# Altium project CYBERGATE_V1_MASTERBOARD.PrjPcb (part 2 of 2)

## Sheet EtherCAT.SchDoc
size B
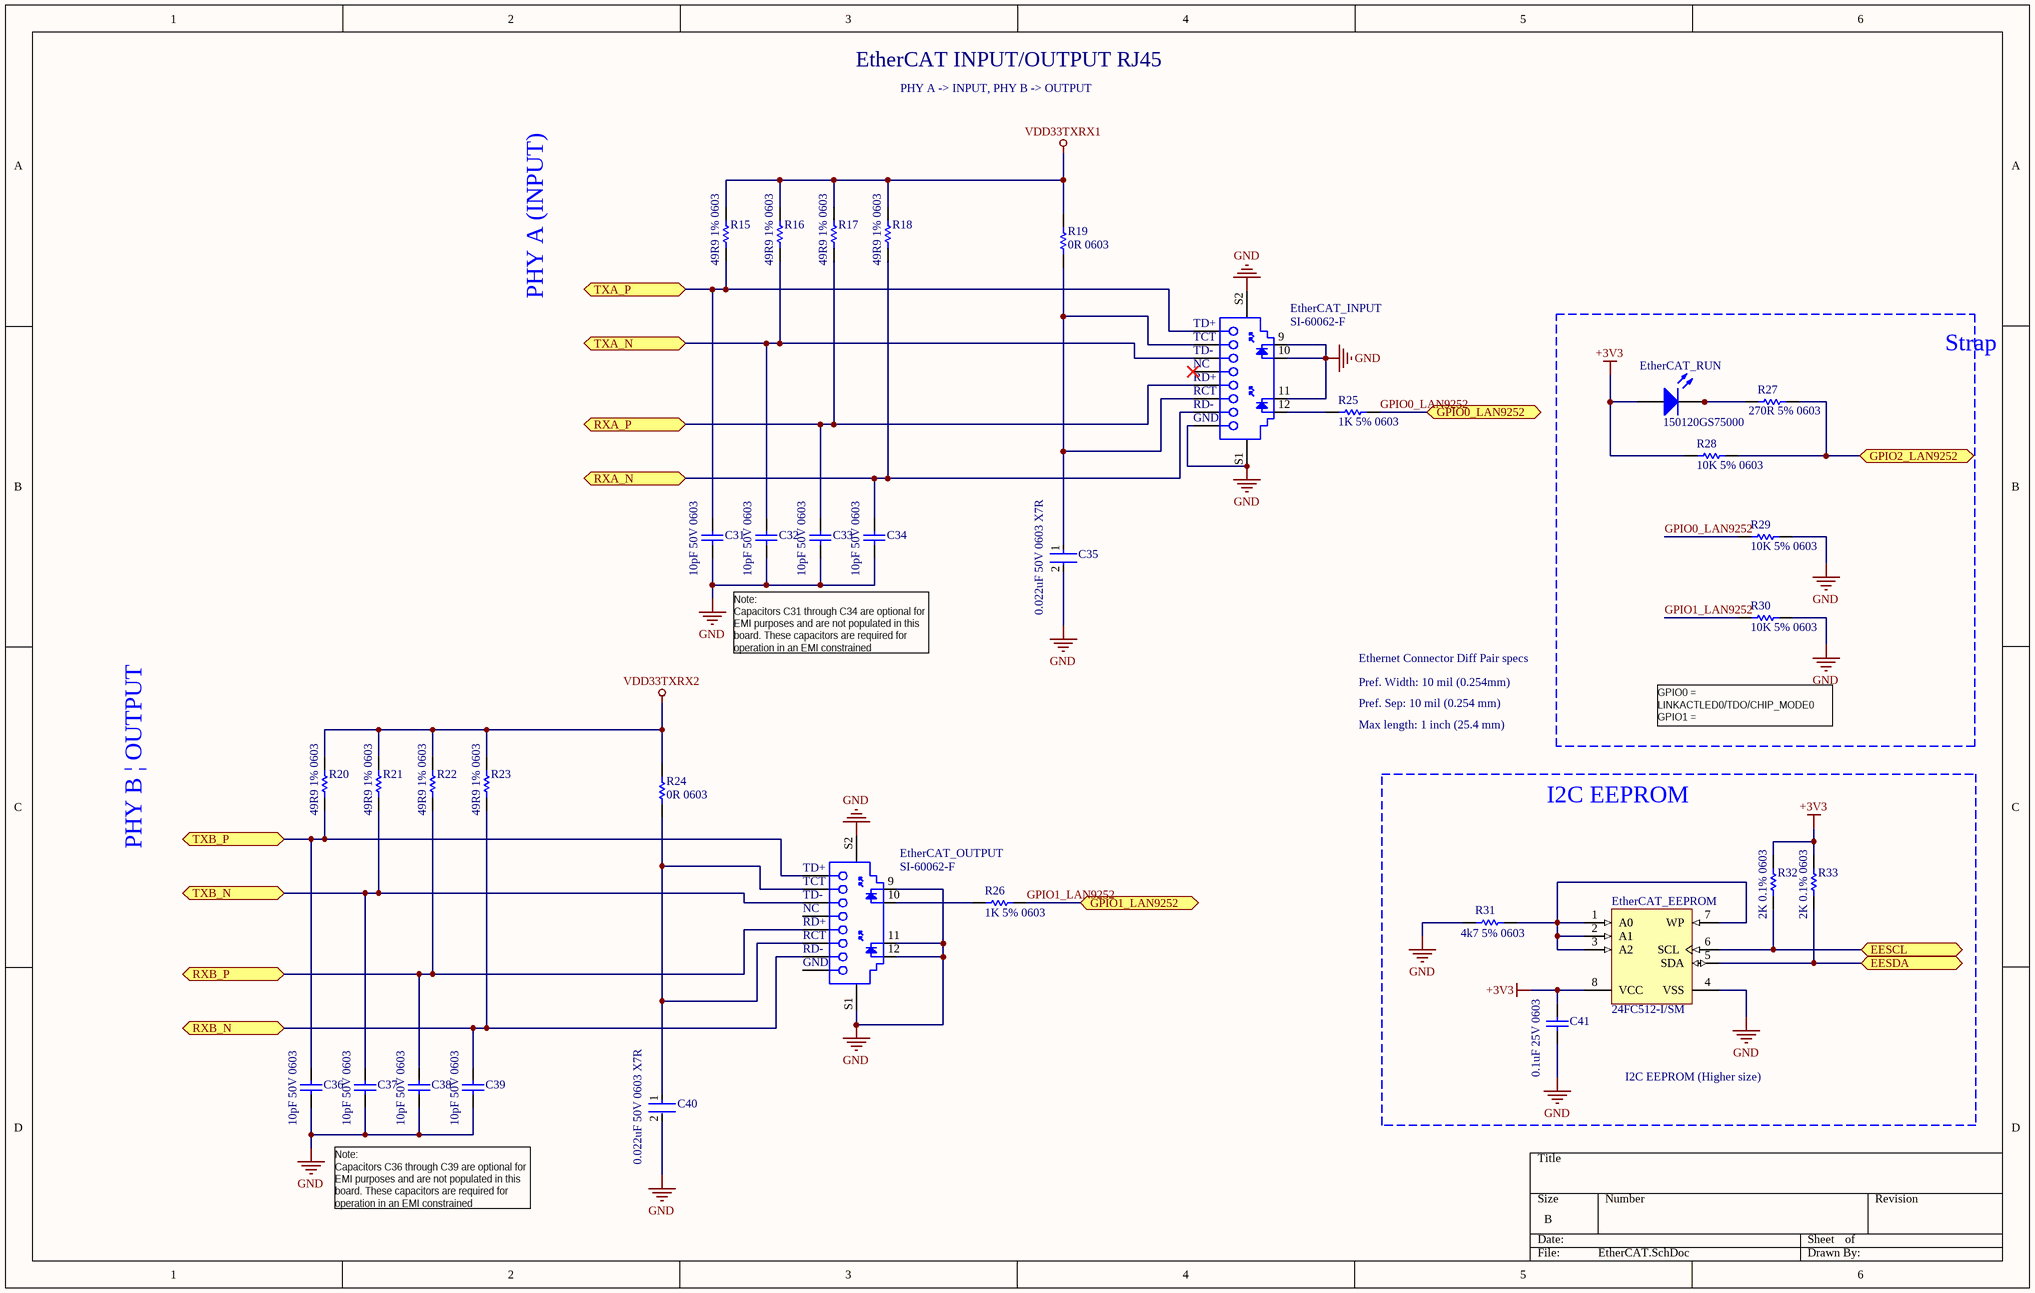
[diagram p4: EtherCAT.SchDoc]

### Parts
C31  10pF 50V 0603  [CAPC1608X90X35LL10T15]
C32  10pF 50V 0603  [CAPC1608X90X35LL10T15]
C33  10pF 50V 0603  [CAPC1608X90X35LL10T15]
C34  10pF 50V 0603  [CAPC1608X90X35LL10T15]
C35  0.022uF 50V 0603 X7R  [FP-C0603C-CF-MFG]
C36  10pF 50V 0603  [CAPC1608X90X35LL10T15]
C37  10pF 50V 0603  [CAPC1608X90X35LL10T15]
C38  10pF 50V 0603  [CAPC1608X90X35LL10T15]
C39  10pF 50V 0603  [CAPC1608X90X35LL10T15]
C40  0.022uF 50V 0603 X7R  [FP-C0603C-CF-MFG]
C41  0.1uF 25V 0603  [CAPC1608X90X35LL10T15]
EtherCAT_EEPROM  24FC512-I/SM  [SOIJ-SM8_M]
EtherCAT_INPUT  SI-60062-F  [BELF-SI-60062-F_V]
EtherCAT_OUTPUT  SI-60062-F  [BELF-SI-60062-F_V]
EtherCAT_RUN  150120GS75000  [1206_A]
R15  49R9 1% 0603  [RESC1608X55X25NL10T15]
R16  49R9 1% 0603  [RESC1608X55X25NL10T15]
R17  49R9 1% 0603  [RESC1608X55X25NL10T15]
R18  49R9 1% 0603  [RESC1608X55X25NL10T15]
R19  0R 0603  [RESC1608X55X25ML10T15]
R20  49R9 1% 0603  [RESC1608X55X25NL10T15]
R21  49R9 1% 0603  [RESC1608X55X25NL10T15]
R22  49R9 1% 0603  [RESC1608X55X25NL10T15]
R23  49R9 1% 0603  [RESC1608X55X25NL10T15]
R24  0R 0603  [RESC1608X55X25ML10T15]
R25  1K 5% 0603  [RESC1608X55X25NL10T15]
R26  1K 5% 0603  [RESC1608X55X25NL10T15]
R27  270R 5% 0603  [RESC1608X55X25LL10T15]
R28  10K 5% 0603  [RESC1608X55X25ML10T15]
R29  10K 5% 0603  [RESC1608X55X25ML10T15]
R30  10K 5% 0603  [RESC1608X55X25ML10T15]
R31  4k7 5% 0603  [RESC1608X55X25ML10T15]
R32  2K 0.1% 0603  [RESC1608X55X25ML10T15]
R33  2K 0.1% 0603  [RESC1608X55X25ML10T15]

### Blocks framed on the sheet
Strap: EtherCAT_RUN R27-R30
I2C EEPROM: C41 EtherCAT_EEPROM R31-R33

### Ports
EESCL (bidir), EESDA (bidir), GPIO0_LAN9252 (bidir), GPIO1_LAN9252 (bidir), GPIO2_LAN9252 (bidir), RXA_N (bidir), RXA_P (bidir), RXB_N (bidir), RXB_P (bidir), TXA_N (bidir), TXA_P (bidir), TXB_N (bidir), TXB_P (bidir)

### Nets
+3V3: C41.2 EtherCAT_EEPROM.8(VCC) EtherCAT_RUN.2(A) R28.2 R32.2 R33.2
GND: C31.1 C32.1 C33.1 C34.1 C35.2 C36.1 C37.1 C38.1 C39.1 C40.2 C41.1 EtherCAT_EEPROM.4(VSS) EtherCAT_INPUT.8(GND) EtherCAT_INPUT.9 EtherCAT_INPUT.10 EtherCAT_INPUT.11 EtherCAT_INPUT.S1 EtherCAT_INPUT.S2 EtherCAT_OUTPUT.9 EtherCAT_OUTPUT.11 EtherCAT_OUTPUT.12 EtherCAT_OUTPUT.S1 EtherCAT_OUTPUT.S2 R29.1 R30.1 R31.1
VDD33TXRX1: R15.2 R16.2 R17.2 R18.2 R19.2
VDD33TXRX2: R20.2 R21.2 R22.2 R23.2 R24.2
GPIO0_LAN9252: R25.2 R29.2 ; port GPIO0_LAN9252
GPIO1_LAN9252: R26.2 R30.2 ; port GPIO1_LAN9252
RXA_N: C34.2 EtherCAT_INPUT.7(RD-) R18.1 ; port RXA_N
RXA_P: C33.2 EtherCAT_INPUT.5(RD+) R17.1 ; port RXA_P
RXB_N: C39.2 EtherCAT_OUTPUT.7(RD-) R23.1 ; port RXB_N
RXB_P: C38.2 EtherCAT_OUTPUT.5(RD+) R22.1 ; port RXB_P
TXA_N: C32.2 EtherCAT_INPUT.3(TD-) R16.1 ; port TXA_N
TXA_P: C31.2 EtherCAT_INPUT.1(TD+) R15.1 ; port TXA_P
TXB_N: C37.2 EtherCAT_OUTPUT.3(TD-) R21.1 ; port TXB_N
TXB_P: C36.2 EtherCAT_OUTPUT.1(TD+) R20.1 ; port TXB_P
NetC35_1: C35.1 EtherCAT_INPUT.2(TCT) EtherCAT_INPUT.6(RCT) R19.1
NetC40_1: C40.1 EtherCAT_OUTPUT.2(TCT) EtherCAT_OUTPUT.6(RCT) R24.1
NetEtherCAT_EEPROM_1: EtherCAT_EEPROM.1(A0) EtherCAT_EEPROM.2(A1) EtherCAT_EEPROM.3(A2) EtherCAT_EEPROM.7(WP) R31.2
NetEtherCAT_EEPROM_5: EtherCAT_EEPROM.5(SDA) R33.1 ; port EESDA
NetEtherCAT_EEPROM_6: EtherCAT_EEPROM.6(SCL) R32.1 ; port EESCL
NetEtherCAT_INPUT_12: EtherCAT_INPUT.12 R25.1
NetEtherCAT_OUTPUT_10: EtherCAT_OUTPUT.10 R26.1
NetEtherCAT_RUN_1: EtherCAT_RUN.1(K) R27.1
NetLAN9252_45: R27.2 R28.1 ; port GPIO2_LAN9252

Not connected (* = marked no-connect by the designer): EtherCAT_INPUT 4(NC)*; EtherCAT_OUTPUT 4(NC) 8(GND)

### Notes on the sheet
- EtherCAT INPUT/OUTPUT RJ45
- PHY A -> INPUT, PHY B -> OUTPUT
- PHY A (INPUT)
- Note:
  Capacitors C31 through C34 are optional for EMI purposes and are not populated in this  board. These capacitors are required for operation in an EMI constrained environment.
- Ethernet Connector Diff Pair specs
- Pref. Width: 10 mil (0.254mm)
- Pref. Sep: 10 mil (0.254 mm)
- Max length: 1 inch (25.4 mm)
- GPIO0 = LINKACTLED0/TDO/CHIP_MODE0
  GPIO1 = LINKACTLED1/TDI/CHIP_MODE1
  GPIO2 = RUNLED/E2PSIZE
- PHY B | OUTPUT
- I2C EEPROM (Higher size)
- Note:
  Capacitors C36 through C39 are optional for EMI purposes and are not populated in this  board. These capacitors are required for operation in an EMI constrained environment.

### Library data of the parts
C31-C34 C36-C39 = CMP-2006-02592-1: Part Number: GRM1885C1H100JA01D; Manufacturer: Murata
C35 C40 = CMP-2006-03879-3: Ceramic Capacitor 0.022Uf 50V, X7R, 10%, 0603, Full Reel; Manufacturer Part Number: C0603C223K5RACTU; Manufacturer: KEMET; Automotive Grade: Grade 1; Capacitance: 22,000 pF; Value: 22,000 pF; Tolerance: 0.1; Temperature Coefficient: 30ppm/°C; Material: Ceramic; Mouser Description: Capacitor; Ceramic; Cap; .022uF; Tol+10%; SMT; Vol-Rtg 50V; X7R; TR; Voltage Rating: 50 V; Category: Cap; Device Class L2: Capacitors; RoHS: TRUE; Package: C0603C-CF; Device Class L1: Passive Components; Temperature Range Low: -55°C; Octopart: https://octopart.com/c0603c223k5ractu-kemet-97352; Temperature: -55°C to +125°C; Temperature Range High: +125°C; Automotive: Yes; Lead Free: Yes; ComponentLink2URL: https://api.kemet.com/component-edge/download/datasheet/C0603C100J5GACAUTO.pdf; Temperature Characteristic: X7R; Height: 0.87mm; Device Class L3: Ceramic Capacitors; Digikey Description: Ceramic Capacitor 0.022Uf 50V, X7R, 10%, 0603, Full Reel; ComponentLink2Description: Datasheet
C41 = CMP-2006-02868-1: Part Number: GRM188R71E104KA01D; Manufacturer: Murata
EtherCAT_EEPROM = CMP-0159-00532-1: 512Kbit, 1MHz, 2.5V, I2C Serial EEPROM, 8-Pin SOIC 208mil, Industrial Temperature; PackageDescription: 8-Lead Plastic Small Outline (SM) - Medium, 5.28 mm Body [SOIJ]; PackageReference: SOIJ-SM8; PackageVersion: revBB, Aug-2009; DatasheetVersion: revJ, Jul-2008
EtherCAT_INPUT EtherCAT_OUTPUT = CMP-2000-07059-1: 1 Port RJ45 Magjack Connector with Yellow and Green LED, 10/100 Base-T, 12-Pin THD, RoHS, Tray; Manufacturer: Bel Fuse; Number of Ways: 8P4C; Gender: Female; Shield Type: STP; Connector Type: RJ45; Contact Plating: Gold; Mounting Type: ThroughHole; Datasheet Version: Rev. B0, 09/2008; Package Reference: SI-60062-F; Manufacturer URL: http://belfuse.com/; Package Description: 12-Pin Through Hole Device, Body 21.59 x 16.13 mm; Series: MagJack; Contact Material: CopperAlloy; Datasheet URL: http://belfuse.com/pdfs/SI-60062-F.pdf; Width: 17.98mm; Length: 15.21mm; Mounting Technology: ThroughHole; Depth: 21.59mm; Orientation: Straight
EtherCAT_RUN = CMP-1426-00014-1: SMD mono-color Chip LED, WL-SMCW, Green; Manufacturer: Wuerth Elektronik; PackageReference: 1206_A; PartNumber: 150120GS75000; ComponentLink1Description: Manufacturer URL; ComponentLink2URL: http://katalog.we-online.com/led/datasheet/150120GS75000.pdf; ComponentLink2Description: Datasheet; Color: Green; ComponentLink1URL: http://www.we-online.com
R15-R18 R20-R23 = CMP-1659-00036-1: General Purpose Chip Resistor, 49.9 Ohm, +/- 1%, -55 to 155 degC, 0603 (1608 Metric), RoHS, Tape and Reel; Max Supply Voltage: 3.63 V; Case\Package: LQFP; Interface: SPI; Min Supply Voltage: 2.97 V; PackageReference: 0603; Packaging: Tray; ComponentLink2Description: Datasheet; ComponentLink1Description: Manufacturer URL; ComponentLink2URL: https://datasheet.ciiva.com/11808/0900766b80f96399-11808223.pdf; RoHSCompliant: true; Max Operating Temperature: 85 degC; ComponentLink1URL: http://www.yageo.com/; PackageDescription: 2-Pin Surface Mount Device, Body 1.6 x 0.8 mm; DatasheetVersion: Rev. 4, 04/2009; Min Operating Temperature: -40 degC; Package Quantity: 250; Pins: 48
R19 R24 = CMP-2100-03667-1: Chip Resistor, 0 Ohm, +/- 5%, 0.1 W, -55 to 155 degC, 0603 (1608 Metric), RoHS, Tape and Reel; Manufacturer: Yageo; Temperature Coefficient: 200ppm/degreesC; Voltage Rating: 50V; Power Rating: 100mW; Resistance: 0mOhm; Width: 0.8mm; Max Operating Temperature: 155degC; Tolerance: 5%; Package Reference: 0603; Height: 0.45mm; Depth: 0.8mm; Package Description: 2-Pin Surface Mount Device, Body 1.6 x 0.8 mm; Termination: SMD/SMT; Package Quantity: 5000; Case/Package: 0603; Case Code (Imperial): 0603; Radiation Hardening: No; Number of Pins: 2; Length: 1.6mm; Lead Free: LeadFree; Voltage Rating (DC): 50V; Military Standard: Not; Datasheet URL: http://www.yageo.com/NewPortal/yageodocoutput?fileName=/pdf/R-Chip/PYu-RC_Group_51_RoHS_L_5.pdf; Manufacturer URL: http://www.yageo.com/; Packaging: TapeandReel; Case Code (Metric): 1608; Min Operating Temperature: -55degC; Composition: ThickFilm; RoHSCompliant: true; Contact Plating: Tin; Datasheet Version: Rev. 5, 10/2016; REACH SVHC: NoSVHC
R25 R26 = CMP-1659-00009-4: Chip Resistor, 1 KOhm, +/-1%, 0.1 W, -55 to 155 degC, 0603 (1608 Metric), RoHS, Tape and Reel; Manufacturer: Yageo; Voltage Rating: 50 V; ComponentLink2URL: http://www.yageo.com/documents/recent/PYu-RC_Group_51_RoHS_L_04.pdf; Max Operating Temperature: 155 degC; PackageDescription: 2-Pin Surface Mount Device, Body 1.6 x 0.8 mm; Packaging: Tape and Reel; ComponentLink3Description: Package Specification; REACH SVHC: No SVHC; Mount: Surface Mount; ComponentLink2Description: Datasheet; Length: 1.6 mm; PackageReference: 0603; Height: 0.45 mm; DatasheetVersion: Rev. 4, 02/2016; Min Operating Temperature: -55 degC; ComponentLink1Description: Manufacturer URL; Package Quantity: 200; RoHSCompliant: true; ComponentLink3URL: http://www.farnell.com/datasheets/443971.pdf; Pins: 2; Mounting Technology: Surface Mount; ComponentLink1URL: http://www.yageo.com/
R27 = CMP-2000-06956-1: Chip Resistor, 270 Ohm, +/- 5%, 0.1 W, -55 to 155 degC, 0603 (1608 Metric), RoHS, Tape and Reel; Manufacturer: Yageo; Resistor Case Style: 0603[1608Metric]; Resistance: 270ohm; Resistor Element Type: ThickFilm; Voltage Rating: 50V; Temperature Coefficient: ±100ppm/°C; SVHC: ToBeAdvised; Product Range: RCSeries; Power Rating: 100mW; MSL: MSL1-Unlimited; Datasheet URL: http://www.yageo.com/documents/recent/PYu-RC_Group_51_RoHS_L_7.pdf; Packaging: CutTape; Manufacturer URL: http://www.yageo.com/; Automotive Qualification Standard: -; Resistance Tolerance: ±5%; Package Reference: 0603; Package Description: 2-Pin Surface Mount Device, Body 1.6 x 0.8 mm; Mounting Technology: SurfaceMount; Datasheet Version: Rev. 7, 05/2017
R28-R30 = CMP-2100-03664-1: Chip Resistor, 10 KOhm, +/- 1%, 01 W, -55 to 155 degC, 0603 (1608 Metric), RoHS, Tape and Reel; Manufacturer: Yageo; Temperature Coefficient: 100ppm/degreesC; Resistance: 10KOhm; Voltage Rating: 75V; Power Rating: 100mW; Voltage Rating (DC): 50V; Composition: ThickFilm; RoHSCompliant: true; Height: 0.45mm; Lead Free: LeadFree; Case Code (Metric): 1608; Case/Package: 0603; Datasheet Version: Rev. 5, 10/2016; Package Reference: 0603; Depth: 0.8mm; Package Description: 2-Pin Surface Mount Device, Body 1.6 x 0.8 mm; Case Code (Imperial): 0603; Packaging: TapeandReel; Termination: SMD/SMT; Lead Pitch: 0.3mm; Width: 0.8mm; Number of Pins: 2; Length: 1.6mm; REACH SVHC: NoSVHC; Military Standard: Not; Max Operating Temperature: 155degC; Min Operating Temperature: -55degC; Manufacturer URL: http://www.yageo.com/; Datasheet URL: http://www.yageo.com/NewPortal/yageodocoutput?fileName=/pdf/R-Chip/PYu-RC_Group_51_RoHS_L_5.pdf; Weight: 7.1E-05oz; Tolerance: 1%
R31 = CMP-2000-05024-1: Chip Resistor, 4.7 KOhm, +/- 5%, 100 mW, -55 to 155 degC, 0603 (1608 Metric), RoHS, Tape and Reel; Manufacturer: Yageo; Resistance: 4.7kOhms; Temperature Coefficient: 100PPM/C; Power Rating: 100mW; Voltage Rating: 50V; Operating Temperature Range: -55Cto+155C; Case Code - mm: 1608; Tolerance: 5%; Product: ThickFilmResistorsGeneralPurpose; Case Code - in: 0603; Datasheet URL: http://www.yageo.com/documents/recent/PYu-RC_Group_51_RoHS_L_04.pdf; Package Reference: 603; Datasheet Version: Rev. 4, 02/2016; Package Description: 2-Pin Surface Mount Device, Body 1.6 x 0.8 mm; Manufacturer URL: http://www.yageo.com/; Series: RC; Packaging: Reel; Termination Style: SMD/SMT
R32 R33 = CMP-2000-04430-1: Part Number: RT0603BRD072KL; Manufacturer: Yageo

## Sheet Ethernet.SchDoc
size B
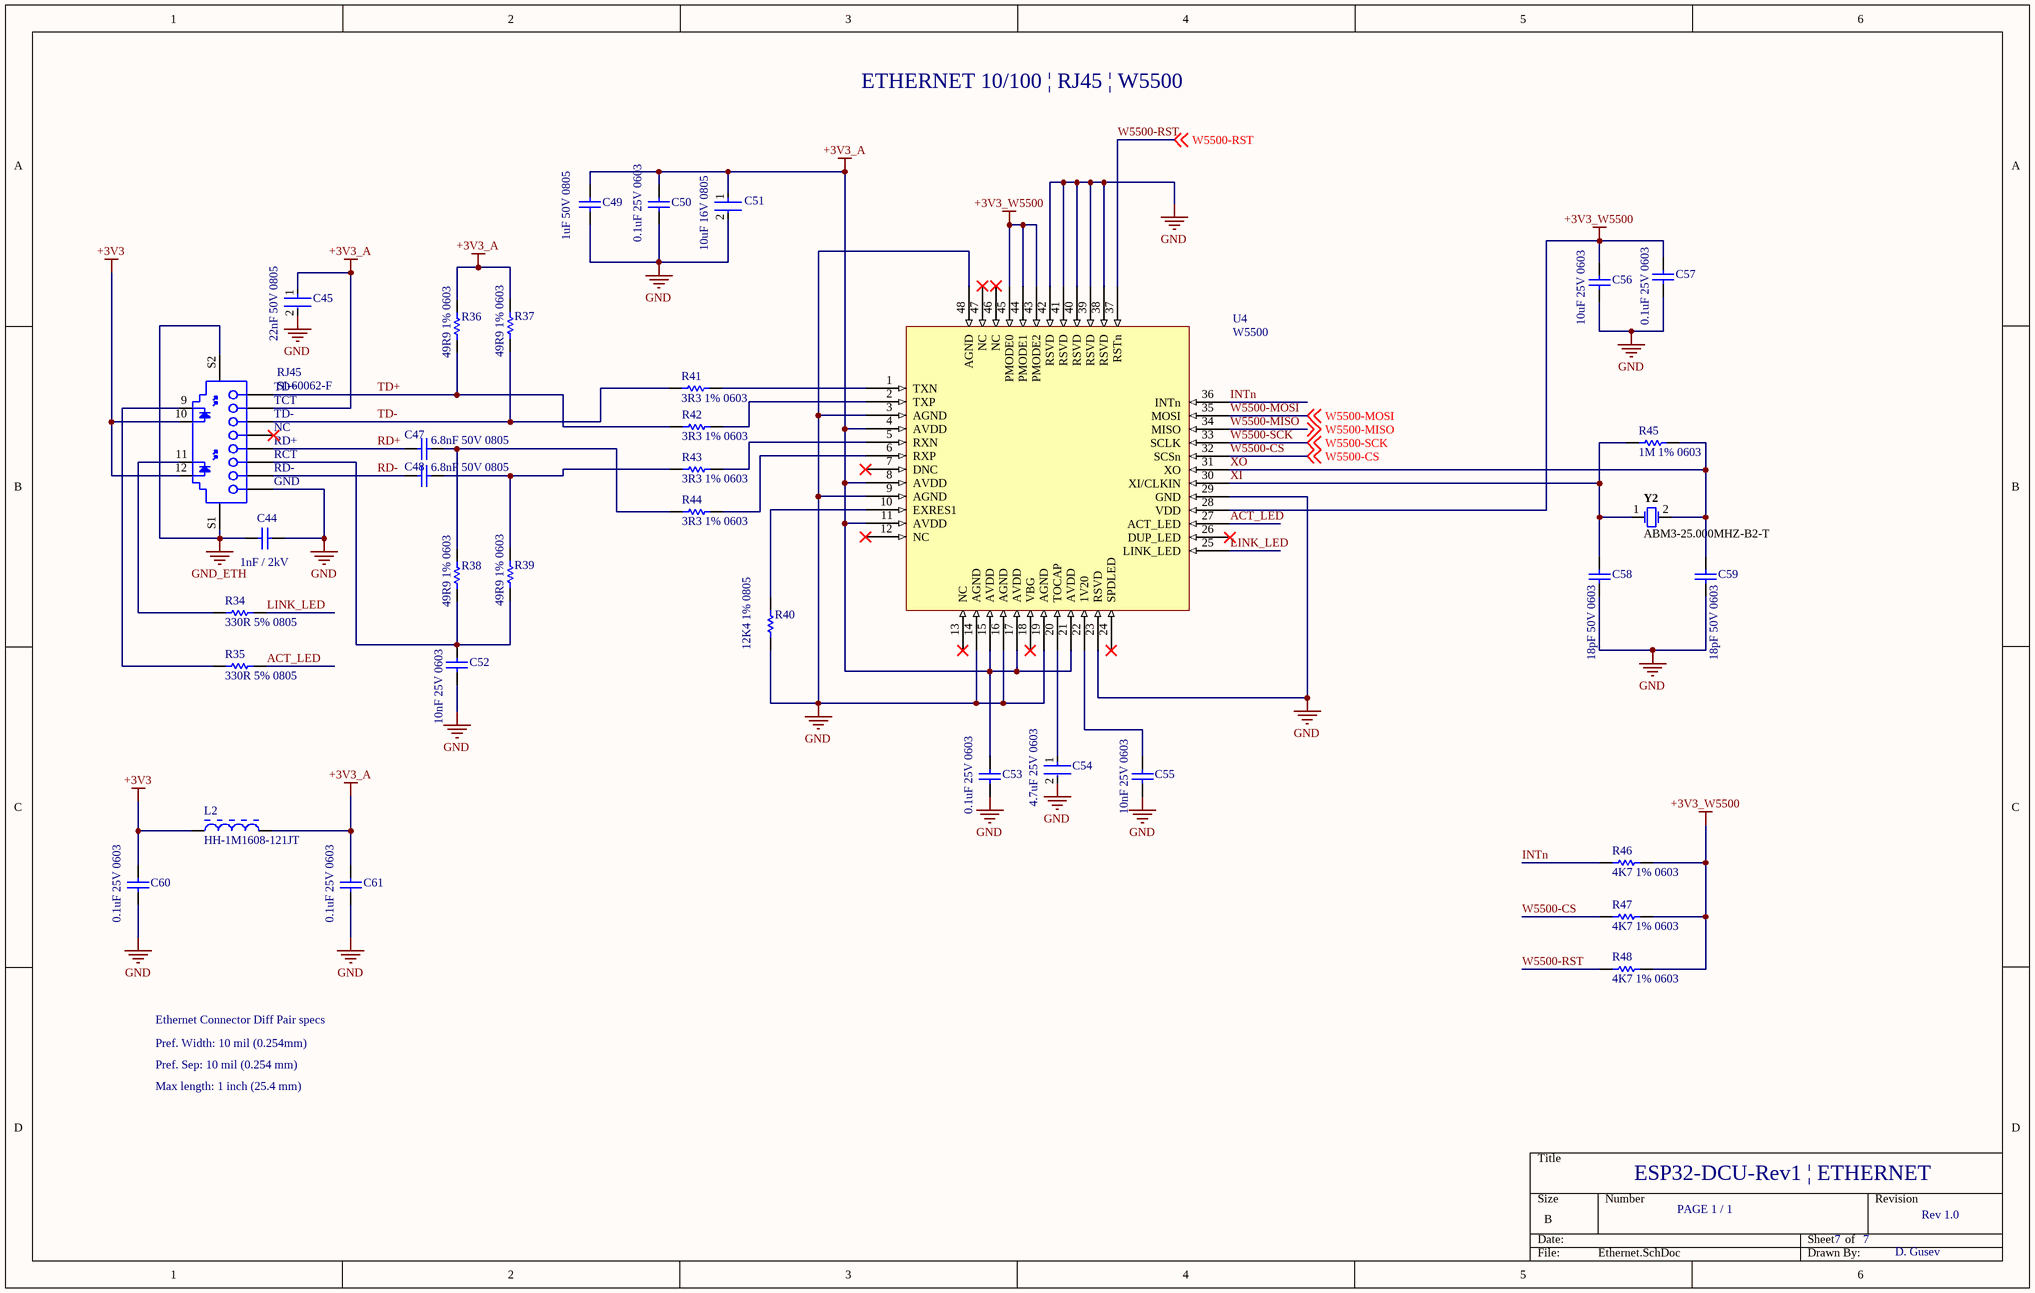
[diagram p5: Ethernet.SchDoc]

### Parts
C44  1nF / 2kV  [CAPC4532X155X60LL30T35]
C45  22nF 50V 0805  [FP-CL21-IPC_A]
C47  6.8nF 50V 0805  [CAPC2013X94X50NL20T25]
C48  6.8nF 50V 0805  [CAPC2013X94X50NL20T25]
C49  1uF 50V 0805  [CAPC2013X135X45LL10T25]
C50  0.1uF 25V 0603  [CAPC1608X90X35LL10T15]
C51  10uF 16V 0805  [FP-GRM21B-0_1-IPC_C]
C52  10nF 25V 0603  [CAPC1608X90X35NL15T15]
C53  0.1uF 25V 0603  [CAPC1608X90X35LL10T15]
C54  4.7uF 25V 0603  [FP-GRM188-0_15-IPC_C]
C55  10nF 25V 0603  [CAPC1608X90X35NL15T15]
C56  10uF 25V 0603  [CAPC1608X100X20VL10T10]
C57  0.1uF 25V 0603  [CAPC1608X90X35LL10T15]
C58  18pF 50V 0603  [CAPC1608X90X40LL10T20]
C59  18pF 50V 0603  [CAPC1608X90X40LL10T20]
C60  0.1uF 25V 0603  [CAPC1608X90X35LL10T15]
C61  0.1uF 25V 0603  [CAPC1608X90X35LL10T15]
L2  HH-1M1608-121JT  [CTC-1608_L]
R34  330R 5% 0805  [RESC2013X60X35LL10T20]
R35  330R 5% 0805  [RESC2013X60X35LL10T20]
R36  49R9 1% 0603  [RESC1608X55X25NL10T15]
R37  49R9 1% 0603  [RESC1608X55X25NL10T15]
R38  49R9 1% 0603  [RESC1608X55X25NL10T15]
R39  49R9 1% 0603  [RESC1608X55X25NL10T15]
R40  12K4 1% 0805  [RESC2013X60X35NL10T20]
R41  3R3 1% 0603  [RESC1608X55X25ML10T15]
R42  3R3 1% 0603  [RESC1608X55X25ML10T15]
R43  3R3 1% 0603  [RESC1608X55X25ML10T15]
R44  3R3 1% 0603  [RESC1608X55X25ML10T15]
R45  1M 1% 0603  [RESC1608X55X25LL10T15]
R46  4K7 1% 0603  [RESC1608X55X25LL10T15]
R47  4K7 1% 0603  [RESC1608X55X25LL10T15]
R48  4K7 1% 0603  [RESC1608X55X25LL10T15]
RJ45  SI-60062-F  [BELF-SI-60062-F_V]
U4  W5500  [W5500]
Y2  ABM3-25.000MHZ-B2-T  [ABRA-ABM3_V]

### Nets
+3V3: C60.2 L2.1 RJ45.10 RJ45.12
+3V3_A: C45.1 C49.2 C50.2 C51.1 C53.2 C61.2 L2.2 R36.2 R37.2 RJ45.2(TCT) U4.4(AVDD) U4.8(AVDD) U4.11(AVDD) U4.15(AVDD) U4.17(AVDD) U4.21(AVDD)
+3V3_W5500: C56.2 C57.2 R46.2 R47.2 R48.2 U4.28(VDD) U4.43(PMODE2) U4.44(PMODE1) U4.45(PMODE0)
GND: C44.2 C45.2 C49.1 C50.1 C51.2 C52.1 C53.1 C54.2 C55.1 C56.1 C57.1 C58.1 C59.1 C60.1 C61.1 R40.1 RJ45.8(GND) U4.3(AGND) U4.9(AGND) U4.14(AGND) U4.16(AGND) U4.19(AGND) U4.23(RSVD) U4.29(GND) U4.38(RSVD) U4.39(RSVD) U4.40(RSVD) U4.41(RSVD) U4.42(RSVD) U4.48(AGND)
GND_ETH: C44.1 RJ45.S1 RJ45.S2
ACT_LED: R35.2 U4.27(ACT_LED)
INTn: R46.1 U4.36(INTn)
LINK_LED: R34.2 U4.25(LINK_LED)
RD+: C47.1 RJ45.5(RD+)
RD-: C48.1 RJ45.7(RD-)
TD+: R36.1 R42.1 RJ45.1(TD+)
TD-: R37.1 R41.1 RJ45.3(TD-)
W5500-CS: R47.1 U4.32(SCSn) ; off-sheet W5500-CS
W5500-MISO: U4.34(MISO) ; off-sheet W5500-MISO
W5500-MOSI: U4.35(MOSI) ; off-sheet W5500-MOSI
W5500-RST: R48.1 U4.37(RSTn) ; off-sheet W5500-RST
W5500-SCK: U4.33(SCLK) ; off-sheet W5500-SCK
XI: C58.2 R45.1 U4.30(XI/CLKIN) Y2.1
XO: C59.2 R45.2 U4.31(XO) Y2.2
NetC47_2: C47.2 R38.2 R44.1
NetC48_2: C48.2 R39.2 R43.1
NetC52_2: C52.2 R38.1 R39.1 RJ45.6(RCT)
NetC54_1: C54.1 U4.20(TOCAP)
NetC55_2: C55.2 U4.22(1V20)
NetR34_1: R34.1 RJ45.11
NetR35_1: R35.1 RJ45.9
NetR40_2: R40.2 U4.10(EXRES1)
NetR41_2: R41.2 U4.1(TXN)
NetR42_2: R42.2 U4.2(TXP)
NetR43_2: R43.2 U4.5(RXN)
NetR44_2: R44.2 U4.6(RXP)

Not connected (* = marked no-connect by the designer): RJ45 4(NC)*; U4 7(DNC)* 12(NC)* 13(NC)* 18(VBG)* 24(SPDLED)* 26(DUP_LED)* 46(NC)* 47(NC)*

### Notes on the sheet
- ETHERNET 10/100 | RJ45 | W5500
- Ethernet Connector Diff Pair specs
- Pref. Width: 10 mil (0.254mm)
- Pref. Sep: 10 mil (0.254 mm)
- Max length: 1 inch (25.4 mm)
- ESP32-DCU-Rev1 | ETHERNET
- PAGE 1 / 1
- 7
- Rev 1.0
- D. Gusev

### Library data of the parts
C44 = CMP-2000-06032-1: Chip Capacitor, 1000 pF, +/- 10%, 2000 V, -55 to 125 degC, 1812 (4532 Metric), RoHS, Tape and Reel; Manufacturer: Kemet; Kits: 399-5086-ND-KITCERHI-VOLTAGECAPS; Catalog Drawings: ACTU_1812; Capacitance: 1000pF; Product Training Modules: CapacitorBasics-TypicalUsesforCapacitors; Online Catalog: X7RDielectricHighVoltage; Other Names: 399-3447-1; Temperature Coefficient: X7R; Voltage - Rated: 2000V(2kV); Family: CeramicCapacitors; Height - Seated (Max): -; Standard Package: 1; Size / Dimension: 0.177"Lx0.126"W(4.50mmx3.20mm); Datasheet URL: http://capacitoredge.kemet.com/capedge2/DataSheet/Datasheet-C1812C102KGRACTU.pdf?pn=C1812C102KGRACTU; Datasheet Version: 09/2016; Thickness (Max): 0.061"(1.55mm); Applications: SMPSFiltering; Package Description: 2-Pin Surface Mount Device, Body 4.5 x 3.2 mm; Package Reference: 1812; Mounting Technology: SurfaceMount; Packaging: CutTape(CT); Manufacturer URL: http://www.kemet.com/; Operating Temperature: -55°C~125°C; Mounting Type: SurfaceMount,MLCC; Features: HighVoltage; Package / Case: 1812(4532Metric); Lead Spacing: -; Tolerance: ±10%; Lead Style: -; Series: C; Category: Capacitors; Ratings: -
C45 = CMP-13271-002911-1: CL21 Series 0805 22nF 50V ±10% Tolerance X7R Multilayer Ceramic Chip Capacitor; Depth: 1.25mm; Thickness: 0.03inch; Height: 0.65mm; Material: Ceramic; Case/Package: 0805; Voltage Rating (DC): 50V; Contact Plating: Tin; Package Quantity: 1; Case Code (Metric): 2012; Max Operating Temperature: 125°C; Packaging: Tape and Reel; Voltage Rating: 50V; Radiation Hardening: No; Length: 2mm; Mount: Surface Mount; Min Operating Temperature: -55°C; Tolerance: 10%; Case Code (Imperial): 0805; Voltage: 50V; Capacitance: 22nF; Dielectric: X7R; Lead Free: Lead Free; Width: 0.049inch
C47 C48 = CMP-1036-03710-2: Manufacturer: AVX Interconnect / Elco; Part Number: 08055C682KAT2A
C49 = CMP-1036-04761-2: Manufacturer: Murata; Part Number: GRM21BR71H105KA12L
C50 C53 C57 C60 C61 = CMP-2006-02868-1: as C41 on sheet EtherCAT
C51 = CMP-2007-03453-2: Chip Multilayer Ceramic Capacitors for General Purpose, 0805, 10uF, X5R, 15%, 10%, 16V; Radiation Hardening: No; Thickness: 0.053inch; Voltage Rating (DC): 16V; Lead Free: Lead Free; Package Quantity: 1; Width: 1.25mm; Case Code (Imperial): 0805; Depth: 1.25mm; Packaging: Tape and Reel; Dielectric: X5R; Max Operating Temperature: 85°C; Tolerance: 10%; Voltage Rating: 16V; Voltage: 16V; Capacitance: 10uF; Height: 1.25mm; Case Code (Metric): 2012; Material: Ceramic; Mount: Surface Mount; Case/Package: 0805; REACH SVHC: No SVHC; Length: 2mm; Min Operating Temperature: -55°C; Termination: SMD/SMT
C52 C55 = CMP-2006-04155-1: Part Number: 06033C103KAT2A; Manufacturer: AVX Interconnect / Elco
C54 = CMP-2006-02523-2: Chip Multilayer Ceramic Capacitors for General Purpose, 0603, 4.7uF, X5R, 15%, 10%, 25V; Case Code (Metric): 1608; Max Operating Temperature: 85°C; REACH SVHC: No SVHC; Voltage Rating: 25V; Dielectric: X5R; Packaging: Cut Tape; Width: 0.031inch; Min Operating Temperature: -55°C; Lead Free: Lead Free; Capacitance: 4.7uF; Height: 0.8mm; Case Code (Imperial): 0603; Length: 1.6mm; Voltage Rating (DC): 25V; Case/Package: 0603; Voltage: 25V; Tolerance: 10%; Thickness: 0.031inch; Mount: Surface Mount; Material: Ceramic; Package Quantity: 4000; Depth: 0.8mm
C56 = CMP-2000-05442-1: Chip Capacitor, 10 uF, +/- 20%, 25 V, -55 to 85 degC, 0603 (1608 Metric), RoHS, Tape and Reel; Manufacturer: TDK; PCN Part Number: MLCCPartNumberChange30/Nov/2012; Other Names: 445-9015-1; Capacitance: 10µF; Design Resources: 20WNon-IsolatedBuckLEDDriverUsingPLLNK460KG; Kits: 445-9014-KIT-ND-KITMLCC100PF-22UF060310-50V; Product Training Modules: SEAT,CCV,andTVCLDesignToolsGuidetoReplacinganElectrolyticCapacitorwithanMLCC; Online Catalog: CSeries,GeneralPurpose; Temperature Coefficient: X5R; Package Description: 2-Pin Surface Mount Device, Body 1.6 x 0.8 mm; Lead Style: -; Datasheet URL: http://download.siliconexpert.com/pdfs/2016/2/22/9/40/35/949/tdk_/manual/8010476609961980104703407078c1608x5r1e106m080ac.pdf.pdf; Category: Capacitors; Package / Case: 0603(1608Metric); Packaging: CutTape(CT); Series: C; Features: -; Family: CeramicCapacitors; Standard Package: 1; Tolerance: ±20%; Operating Temperature: -55degC~85degC; Mounting Type: SurfaceMount,MLCC; Ratings: -; Size / Dimension: 0.063"Lx0.031"W(1.60mmx0.80mm); Applications: GeneralPurpose; Package Reference: 1608; RoHS Information: RoHSCertificate-MLCC; Manufacturer URL: http://www.tdk.com/; Datasheet Version: Feb-16; Voltage - Rated: 25V; Height - Seated (Max): -; Thickness (Max): 0.039"(1.00mm); Lead Spacing: -
C58 C59 = CMP-1659-00030-1: Chip Capacitor, 18 pF, +/- 5%, 50 V, -55 to 125 degC, 0603 (1608 Metric), RoHS, Tape and Reel; Case\Package: 0603; Power Rating: 100 mW; Resistance: 68.1 Ohm; Tolerance: 1%; Case Code (Metric): 1608; Max Operating Temperature: 155 degC; RoHSCompliant: true; Case Code (Imperial): 0603; Voltage Rating: 50 V; ComponentLink2Description: Datasheet; Package Quantity: 200; PackageReference: 0603; ComponentLink2URL: http://www.yageo.com/NewPortal/yageodocoutput?fileName=/pdf/MLCC/UPY-GP_NP0_16V-to-50V_14.pdf; Length: 1.6 mm; DatasheetVersion: Rev. 14, 07/2016; Min Operating Temperature: -55 degC; ComponentLink1URL: http://www.yageo.com/; Width: 0.8 mm; ComponentLink1Description: Manufacturer URL; Height: 0.45 mm; Radiation Hardening: No; PackageDescription: 2-Pin Surface Mount Device, Body 1.6 x 0.8 mm; Packaging: Tape and Reel
L2 = CMP-2000-06403-1: Chip Ferrite Bead, 0.14 Ohm, 1.1 A, -55 to 125 degC, 2-Pin SMD, RoHS, Tape and Reel; Manufacturer: CTC Coils; DC Resistance Max: 140MOhm; DC Current Max: 1.1A; Datasheet Version: 07/2004; Datasheet URL: http://data.icbank.com/ICBShop/board/beadhbm.pdf; PartNumber: HH-1M1608; Package Reference: 1608; Temperature Min: -55degC; Manufacturer URL: http://www.brokerforum.com/components-parts/CTCCoils-e-en.jsa; Mounting Technology: SurfaceMount; Temperature Max: 125degC; Package Description: 2-Pin Surface Mount Device, Body 1.6 x 0.8 mm; Packing: TapeandReel
R34 R35 = CMP-2000-06960-1: Chip Resistor, 330 Ohm, +/- 1%, 125 mW, -55 to 155 degC, 0805 (2012 Metric), RoHS, Tape and Reel; Manufacturer: Yageo; Voltage Rating: 150V; Temperature Coefficient: 100PPM/C; Power Rating: 125mW(1/8W); Resistance: 330Ohms; Datasheet Version: Rev. 7, 05/2017; Termination Style: SMD/SMT; Case Code - mm: 2012; Package Description: 2-Pin Surface Mounted Device, Body 2 x 1.25 mm; Operating Temperature Range: -55Cto+155C; Case Code - in: 0805; Packaging: Reel; Tolerance: 1%; Package Reference: 0805; Mounting Technology: SurfaceMount; Product: ThickFilmResistorsGeneralPurpose; Series: RC; Manufacturer URL: http://www.yageo.com/; Datasheet URL: http://www.yageo.com/documents/recent/PYu-RC_Group_51_RoHS_L_7.pdf
R36-R39 = CMP-1659-00036-1: as R15 on sheet EtherCAT; PackageReference: 0603; Packaging: Tray; ComponentLink2Description: Datasheet; ComponentLink1Description: Manufacturer URL; ComponentLink2URL: https://datasheet.ciiva.com/11808/0900766b80f96399-11808223.pdf; RoHSCompliant: true; Max Operating Temperature: 85 degC; ComponentLink1URL: http://www.yageo.com/; PackageDescription: 2-Pin Surface Mount Device, Body 1.6 x 0.8 mm; DatasheetVersion: Rev. 4, 04/2009; Min Operating Temperature: -40 degC; Package Quantity: 250; Pins: 48
R40 = CMP-2001-00911-1: Part Number: RC0805FR-0712K4L; Manufacturer: Yageo
R41-R44 = CMP-2000-04272-1: Part Number: RC0603JR-073R3L; Manufacturer: Yageo
R45 = CMP-2000-04829-1: Manufacturer: Yageo; Part Number: AC0603FR-071ML
R46-R48 = CMP-2000-06942-1: Chip Resistor, 4.7 KOhm, +/- 1%, 0.1 W, -55 to 155 degC, 0603 (1608 Metric), RoHS, Tape and Reel; Manufacturer: Yageo; Power Rating: 100mW; Temperature Coefficient: 100PPM/C; Resistance: 4.7kOhms; Voltage Rating: 50V; Package Reference: 0603; Series: RC; Datasheet Version: Rev. 7, 05/2017; Packaging: Reel; Termination Style: SMD/SMT; Datasheet URL: http://www.yageo.com/documents/recent/PYu-RC_Group_51_RoHS_L_7.pdf; Manufacturer URL: http://www.yageo.com/; Package Description: 2-Pin Surface Mount Device, Body 1.6 x 0.8 mm; Case Code - mm: 1608; Case Code - in: 0603; Mounting Technology: SurfaceMount; Operating Temperature Range: -55Cto+155C; Tolerance: 1%; Product: ThickFilmResistorsGeneralPurpose
RJ45 = CMP-2000-07059-1: as EtherCAT_INPUT on sheet EtherCAT; Connector Type: RJ45; Contact Plating: Gold; Mounting Type: ThroughHole; Datasheet Version: Rev. B0, 09/2008; Package Reference: SI-60062-F; Manufacturer URL: http://belfuse.com/; Package Description: 12-Pin Through Hole Device, Body 21.59 x 16.13 mm; Series: MagJack; Contact Material: CopperAlloy; Datasheet URL: http://belfuse.com/pdfs/SI-60062-F.pdf; Width: 17.98mm; Length: 15.21mm; Mounting Technology: ThroughHole; Depth: 21.59mm; Orientation: Straight
U4 = W5500: W5500 10/100 ETHERNET
Y2 = CMP-2000-05729-1: Miniature Ceramic Crystal, 25 MHz, +/- 20 ppm, -20 to 70 degC, 2-Pin SMD, RoHS, Tape and Reel; Manufacturer: ABRACON; Case Height: 1.3mm; Tolerance: 20PPM; Load Capacitance: 18pF; Frequency: 25MHz; ESR: 30Ohms; Frequency Stability: 50PPM; Case Width: 3.2mm; Case Length: 5mm; Packaging: Reel; Package Description: 2-Pin Surface Mount Device, Body 5 x 3.2 mm; Manufacturer URL: http://www.abracon.com/; Mounting Technology: SurfaceMount; RoHS: Details; Operating Temperature Range: -20Cto+70C; Datasheet URL: http://www.abracon.com/Resonators/abm3.pdf; Type: MiniatureCeramicCrystal; Series: ABM3; Product Category: Crystals; Factory Pack Quantity: 1000; Mounting Style: SMD/SMT; Brand: ABRACON; Datasheet Version: 09/2013; Dimensions: 3.2mmWx5mmLx1.3mmH; Termination Style: SMD/SMT; Package Reference: ABM3; Package / Case: 5mmx3.2mm

## Sheet MASTER_GPIO.SchDoc
size B
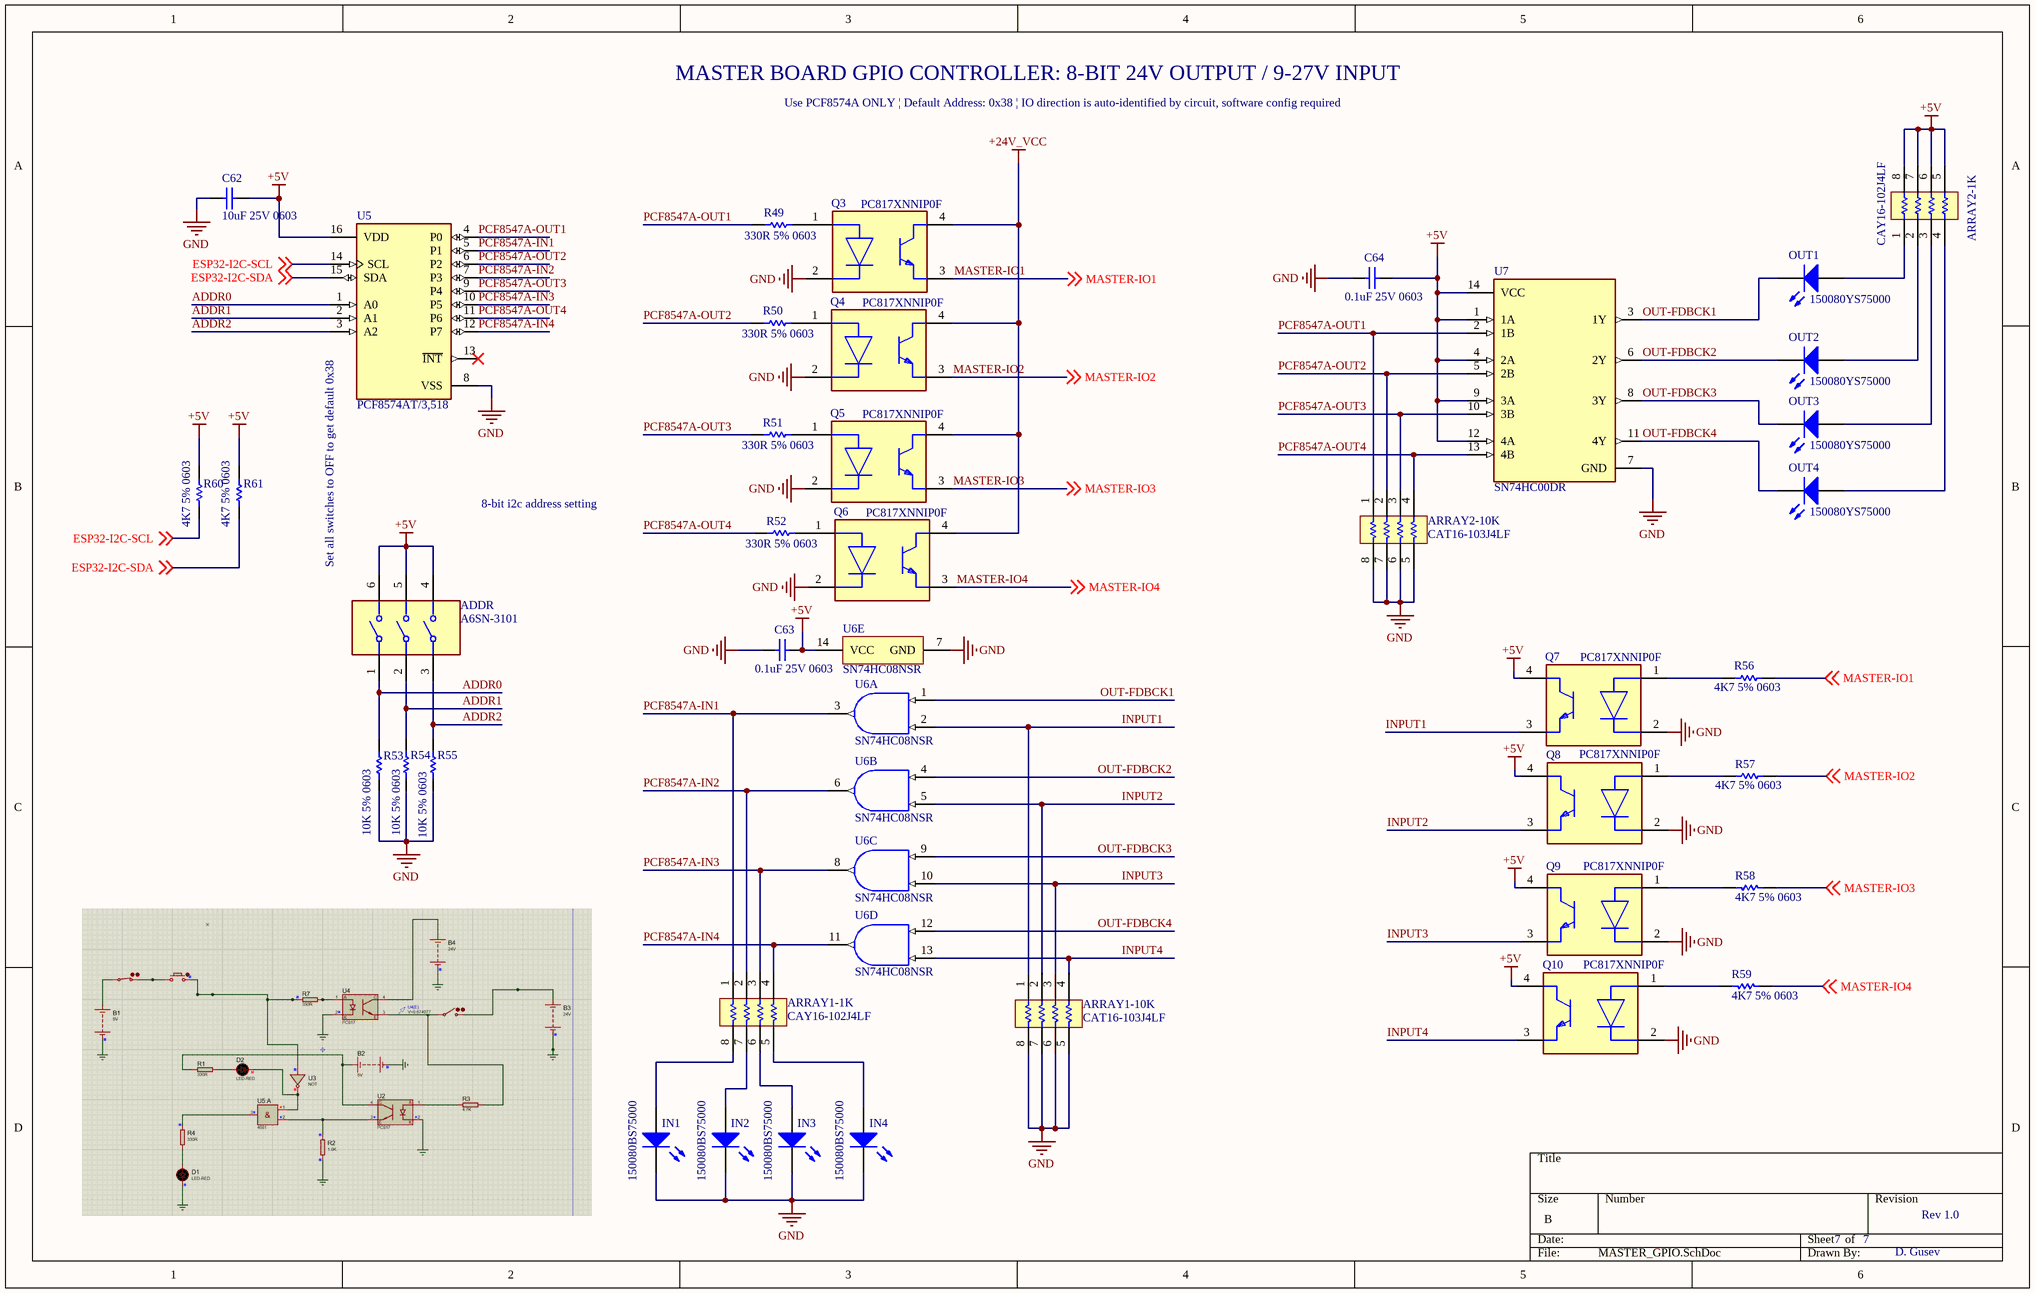
[diagram p6: MASTER_GPIO.SchDoc]

### Parts
ADDR  A6SN-3101  [FP-A6SN-3101-MFG]
ARRAY1-1K  CAY16-102J4LF  [BOUR-CAY16-J4_V]
ARRAY1-10K  CAT16-103J4LF  [BOUR-CAT16-103J4LF_L]
ARRAY2-1K  CAY16-102J4LF  [BOUR-CAY16-J4_V]
ARRAY2-10K  CAT16-103J4LF  [BOUR-CAT16-103J4LF_L]
C62  10uF 25V 0603  [CAPC1608X100X20VL10T10]
C63  0.1uF 25V 0603  [CAPC1608X90X35LL10T15]
C64  0.1uF 25V 0603  [CAPC1608X90X35LL10T15]
IN1  150080BS75000  [0805_A]
IN2  150080BS75000  [0805_A]
IN3  150080BS75000  [0805_A]
IN4  150080BS75000  [0805_A]
OUT1  150080YS75000  [0805_A]
OUT2  150080YS75000  [0805_A]
OUT3  150080YS75000  [0805_A]
OUT4  150080YS75000  [0805_A]
Q3  PC817XNNIP0F  [FP-PC817XNNIP0F-MFG]
Q4  PC817XNNIP0F  [FP-PC817XNNIP0F-MFG]
Q5  PC817XNNIP0F  [FP-PC817XNNIP0F-MFG]
Q6  PC817XNNIP0F  [FP-PC817XNNIP0F-MFG]
Q7  PC817XNNIP0F  [FP-PC817XNNIP0F-MFG]
Q8  PC817XNNIP0F  [FP-PC817XNNIP0F-MFG]
Q9  PC817XNNIP0F  [FP-PC817XNNIP0F-MFG]
Q10  PC817XNNIP0F  [FP-PC817XNNIP0F-MFG]
R49  330R 5% 0603  [RESC1608X55X25NL10T15]
R50  330R 5% 0603  [RESC1608X55X25NL10T15]
R51  330R 5% 0603  [RESC1608X55X25NL10T15]
R52  330R 5% 0603  [RESC1608X55X25NL10T15]
R53  10K 5% 0603  [RESC1608X55X25ML10T15]
R54  10K 5% 0603  [RESC1608X55X25ML10T15]
R55  10K 5% 0603  [RESC1608X55X25ML10T15]
R56  4K7 5% 0603  [RESC1608X55X25LL10T15]
R57  4K7 5% 0603  [RESC1608X55X25LL10T15]
R58  4K7 5% 0603  [RESC1608X55X25LL10T15]
R59  4K7 5% 0603  [RESC1608X55X25LL10T15]
R60  4K7 5% 0603  [RESC1608X55X25LL10T15]
R61  4K7 5% 0603  [RESC1608X55X25LL10T15]
U5  PCF8574AT/3,518  [FP-SOT162-1-MFG]
U6  SN74HC08NSR  [NS0014A_M]  (parts A,B,C,D,E of 5)
U7  SN74HC00DR  [FP-D0014A-MFG]

### Nets
+5V: ADDR.4 ADDR.5 ADDR.6 ARRAY2-1K.5 ARRAY2-1K.6 ARRAY2-1K.7 ARRAY2-1K.8 C62.1 C63.1 C64.1 Q7.4(C) Q8.4(C) Q9.4(C) Q10.4(C) R60.2 R61.2 U5.16(VDD) U6.14(VCC) U7.1(1A) U7.4(2A) U7.9(3A) U7.12(4A) U7.14(VCC)
+24V_VCC: Q3.4(C) Q4.4(C) Q5.4(C) Q6.4(C)
GND: ARRAY1-10K.5 ARRAY1-10K.6 ARRAY1-10K.7 ARRAY1-10K.8 ARRAY2-10K.5 ARRAY2-10K.6 ARRAY2-10K.7 ARRAY2-10K.8 C62.2 C63.2 C64.2 IN1.1(K) IN2.1(K) IN3.1(K) IN4.1(K) Q3.2(C) Q4.2(C) Q5.2(C) Q6.2(C) Q7.2(C) Q8.2(C) Q9.2(C) Q10.2(C) R53.1 R54.1 R55.1 U5.8(VSS) U6.7(GND) U7.7(GND)
ADDR0: ADDR.1 R53.2 U5.1(A0)
ADDR1: ADDR.2 R54.2 U5.2(A1)
ADDR2: ADDR.3 R55.2 U5.3(A2)
ESP32-I2C-SCL: R60.1 U5.14(SCL) ; off-sheet ESP32-I2C-SCL
ESP32-I2C-SDA: R61.1 U5.15(SDA) ; off-sheet ESP32-I2C-SDA
INPUT1: ARRAY1-10K.1 Q7.3(E) U6.2(1B)
INPUT2: ARRAY1-10K.2 Q8.3(E) U6.5(2B)
INPUT3: ARRAY1-10K.3 Q9.3(E) U6.10(3B)
INPUT4: ARRAY1-10K.4 Q10.3(E) U6.13(4B)
MASTER-IO1: Q3.3(E) R56.2 ; off-sheet MASTER-IO1
MASTER-IO2: Q4.3(E) R57.2 ; off-sheet MASTER-IO2
MASTER-IO3: Q5.3(E) R58.1 ; off-sheet MASTER-IO3
MASTER-IO4: Q6.3(E) R59.1 ; off-sheet MASTER-IO4
OUT-FDBCK1: OUT1.1(K) U6.1(1A) U7.3(1Y)
OUT-FDBCK2: OUT2.1(K) U6.4(2A) U7.6(2Y)
OUT-FDBCK3: OUT3.1(K) U6.9(3A) U7.8(3Y)
OUT-FDBCK4: OUT4.1(K) U6.12(4A) U7.11(4Y)
PCF8547A-IN1: ARRAY1-1K.1 U5.5(P1) U6.3(1Y)
PCF8547A-IN2: ARRAY1-1K.2 U5.7(P3) U6.6(2Y)
PCF8547A-IN3: ARRAY1-1K.3 U5.10(P5) U6.8(3Y)
PCF8547A-IN4: ARRAY1-1K.4 U5.12(P7) U6.11(4Y)
PCF8547A-OUT1: ARRAY2-10K.1 R49.1 U5.4(P0) U7.2(1B)
PCF8547A-OUT2: ARRAY2-10K.2 R50.1 U5.6(P2) U7.5(2B)
PCF8547A-OUT3: ARRAY2-10K.3 R51.1 U5.9(P4) U7.10(3B)
PCF8547A-OUT4: ARRAY2-10K.4 R52.1 U5.11(P6) U7.13(4B)
NetARRAY1-1K_5: ARRAY1-1K.5 IN4.2(A)
NetARRAY1-1K_6: ARRAY1-1K.6 IN3.2(A)
NetARRAY1-1K_7: ARRAY1-1K.7 IN2.2(A)
NetARRAY1-1K_8: ARRAY1-1K.8 IN1.2(A)
NetARRAY2-1K_1: ARRAY2-1K.1 OUT1.2(A)
NetARRAY2-1K_2: ARRAY2-1K.2 OUT2.2(A)
NetARRAY2-1K_3: ARRAY2-1K.3 OUT3.2(A)
NetARRAY2-1K_4: ARRAY2-1K.4 OUT4.2(A)
NetQ3_1: Q3.1(A) R49.2
NetQ4_1: Q4.1(A) R50.2
NetQ5_1: Q5.1(A) R51.2
NetQ6_1: Q6.1(A) R52.2
NetQ7_1: Q7.1(A) R56.1
NetQ8_1: Q8.1(A) R57.1
NetQ9_1: Q9.1(A) R58.2
NetQ10_1: Q10.1(A) R59.2

Not connected (* = marked no-connect by the designer): U5 13(~{INT})*

### Notes on the sheet
- MASTER BOARD GPIO CONTROLLER: 8-BIT 24V OUTPUT / 9-27V INPUT
- Use PCF8574A ONLY | Default Address: 0x38 | IO direction is auto-identified by circuit, software config required
- Set all switches to OFF to get default 0x38
- 8-bit i2c address setting
- 7
- Rev 1.0
- D. Gusev

### Library data of the parts
ADDR = CMP-08827-000007-1: SWITCH SLIDE DIP SPST 25MA 24V; Manufacturer: Omron Electronics Inc-EMC Div; Electromechanical Life: 1000Cycles; Contact Resistance: 200mΩ; Standoff Height: 0.7mm; Number Of Circuits: 3; Device Class L2: Switches; Device Class L3: DIP Switches; Ambient Temperature Range High: +85°C; RoHS: TRUE; Temperature Range High: +85°C; Ambient Temperature Range Low: -30°C; ComponentLink2URL: https://omronfs.omron.com/en_US/ecb/products/pdf/en-a6sn.pdf; Category: Switch; Temperature Range Low: -30°C; Digikey Description: SWITCH SLIDE DIP SPST 25MA 24V; Package: A6SN-3101; Mouser Description: DIP Switches / SIP Switches 3P Knife-Edge, 2.3mm Slide SMT Flat-Act; Device Class L1: Electromechanical; Current Rating: 25mA; Lead Free: Yes; ComponentLink2Description: Datasheet; Throw Configuration: SPST; Voltage Rating Dc: 24V; Height: 4.55mm; Octopart: https://octopart.com/a6sn-3101-omron-55396000; Automotive: No; Manufacturer Part Number: A6SN-3101; Temperature: -30°C to +85°C
ARRAY1-1K ARRAY2-1K = CMP-1747-00007-1: Chip Resistor Array, 1 KOhm, +/- 5%, 62.5 mW, -55 to 125 degC, 8-Pin SMD, RoHS, Tape and Reel; Power Rating: 100 mW; Tolerance: 1%; Voltage Rating (DC): 50 V; Resistance: 330 Ohm; Case\Package: 0603; RoHSCompliant: true; Case Code (Metric): 1608; Pins: 2; PackageDescription: 8-Pin Surface Mount Device, Body 1.6 x 3.2 mm, Pitch 0.8 mm; Height: 0.45 mm; Min Operating Temperature: -55 degC; ComponentLink1URL: http://www.bourns.com/; Case Code (Imperial): 0603; Packaging: Tape and Reel; PackageReference: CAY16-J4; ComponentLink1Description: Manufacturer URL; ComponentLink2Description: Datasheet; Length: 1.6 mm; Width: 0.8 mm; Max Operating Temperature: 155 degC; Mount: Surface Mount; DatasheetVersion: Sep-14; Voltage Rating: 50 V; REACH SVHC: No SVHC; ComponentLink2URL: http://www.bourns.com/pdfs/CATCAY.pdf; Package Quantity: 5000
ARRAY1-10K ARRAY2-10K = CMP-2000-06067-1: CAT / CAY 16 Series - Chip Resistor Array, 10 KOhm, +/- 5%, 50 V, -55 to 125 degC, 8-Pin SMD, RoHS, Tape and Reel; Manufacturer: Bourns; Power Per Element: 62.5mW; Online Catalog: CAT16Series; Resistance (Ohms): 10k; Number of Resistors: 4; EDA / CAD Models: DownloadfromAcceleratedDesigns; Temperature Coefficient: ±200ppm/°C; Circuit Type: Isolated; Other Names: CAT16-103J4LFDKR; Package Reference: CAT16-103J4LF; Datasheet Version: 09/2014; Series: CAT16; Manufacturer URL: http://www.bourns.com/; Mounting Type: SurfaceMount; Datasheet URL: http://www.mouser.com/ds/2/54/ATCAY-777361.pdf; Category: Resistors; Height: 0.024"(0.60mm); Mounting Technology: SurfaceMount; Applications: -; Size / Dimension: 0.126"Lx0.061"W(3.20mmx1.55mm); Packaging: Digi-Reel®; Package / Case: 1206(3216Metric),Concave,LongSideTerminals; Supplier Device Package: 1206; RoHS Information: CAT16MaterialDeclaration; Number of Pins: 8; Family: ResistorNetworks,Arrays; Standard Package: 1; Package Description: 8-Pin Surface Mount Device, Body 3.2 x 1.55 mm, Pitch 0.8 mm; Operating Temperature: -55°C~125°C; Tolerance: ±5%
C62 = CMP-2000-05442-1: as C56 on sheet Ethernet; Package Description: 2-Pin Surface Mount Device, Body 1.6 x 0.8 mm; Lead Style: -; Datasheet URL: http://download.siliconexpert.com/pdfs/2016/2/22/9/40/35/949/tdk_/manual/8010476609961980104703407078c1608x5r1e106m080ac.pdf.pdf; Category: Capacitors; Package / Case: 0603(1608Metric); Packaging: CutTape(CT); Series: C; Features: -; Family: CeramicCapacitors; Standard Package: 1; Tolerance: ±20%; Operating Temperature: -55degC~85degC; Mounting Type: SurfaceMount,MLCC; Ratings: -; Size / Dimension: 0.063"Lx0.031"W(1.60mmx0.80mm); Applications: GeneralPurpose; Package Reference: 1608; RoHS Information: RoHSCertificate-MLCC; Manufacturer URL: http://www.tdk.com/; Datasheet Version: Feb-16; Voltage - Rated: 25V; Height - Seated (Max): -; Thickness (Max): 0.039"(1.00mm); Lead Spacing: -
C63 C64 = CMP-2006-02868-1: as C41 on sheet EtherCAT
IN1-IN4 = CMP-1426-00008-1: SMD mono-color Chip LED, WL-SMCW, Blue; Manufacturer: Wuerth Elektronik; Color: Blue; ComponentLink2URL: http://katalog.we-online.com/led/datasheet/150080BS75000.pdf; ComponentLink1URL: http://www.we-online.com; ComponentLink2Description: Datasheet; PackageReference: 0805_A; ComponentLink1Description: Manufacturer URL; PartNumber: 150080BS75000
OUT1-OUT4 = CMP-1426-00012-1: as ESP32-RX on sheet USB-ESP32; Color: Yellow; ComponentLink1URL: http://www.we-online.com; PackageReference: 0805_A; ComponentLink2URL: http://katalog.we-online.com/led/datasheet/150080YS75000.pdf; ComponentLink1Description: Manufacturer URL; ComponentLink2Description: Datasheet; PartNumber: 150080YS75000
Q3-Q10 = CMP-65434-000005-1: OPTOISOLATOR 5KV TRANS 4SMD; Reverse Breakdown Voltage: 6V; Output Current per Channel: 30mA; Power Dissipation: 200mW; Collector-emitter Voltage-Max: 200mV; Max Output Voltage: 80V; Input Current: 50mA; Forward Voltage: 1.4V; Fall Time: 18000ns; Number of Elements: 1; Input Type: DC; Packaging: Tape and Reel; RoHS Compliant: Yes; Contact Plating: Copper; Min Operating Temperature: -30°C; Collector Emitter Saturation Voltage: 200mV; Max Input Current: 50mA; Radiation Hardening: No; Max Collector Current: 50mA; Case/Package: SMD/SMT; Mount: Surface Mount; Output Voltage: 80V; Forward Current: 50mA; Max Power Dissipation: 200mW; Collector Emitter Voltage (VCEO): 80V; Number of Channels: 1; Rise Time: 18000ns; Isolation Voltage: 5kV; Number of Pins: 4; Lead Free: Lead Free; Package Quantity: 2000; Isolation Voltage-Max: 5kV; Max Operating Temperature: 100°C
R49-R52 = CMP-1659-00020-2: Chip Resistor, 330 Ohm, +/- 1%, 0.1 W, -55 to 155 degC, 0603 (1608 Metric), RoHS, Tape and Reel; Tolerance: 10%; ESR: 800 mohm; Voltage Rating (DC): 16 V; Capacitance: 47 uF; Length: 7.3 mm; ComponentLink1URL: http://www.yageo.com/; Packaging: Tape and Reel; Pins: 2; ComponentLink1Description: Manufacturer URL; Case Code (Imperial): 2917; REACH SVHC: No SVHC; Width: 4.3 mm; ComponentLink2Description: Datasheet; Voltage Rating: 16 V; RoHSCompliant: True; Max Operating Temperature: 125degC; ComponentLink2URL: http://www.yageo.com/documents/recent/PYu-RC_Group_51_RoHS_L_04.pdf; Min Operating Temperature: -55degC; Case/Package: 2917; Radiation Hardening: No; DatasheetVersion: Rev. 4, 02/2016; Mount: Surface Mount; PackageReference: 0603; Package Quantity: 500; Case Code (Metric): 7343; PackageDescription: 2-Pin Surface Mount Device, Body 1.6 x 0.8 mm; Height: 3.1 mm
R53-R55 = CMP-2100-03664-1: as R28 on sheet EtherCAT; Composition: ThickFilm; RoHSCompliant: true; Height: 0.45mm; Lead Free: LeadFree; Case Code (Metric): 1608; Case/Package: 0603; Datasheet Version: Rev. 5, 10/2016; Package Reference: 0603; Depth: 0.8mm; Package Description: 2-Pin Surface Mount Device, Body 1.6 x 0.8 mm; Case Code (Imperial): 0603; Packaging: TapeandReel; Termination: SMD/SMT; Lead Pitch: 0.3mm; Width: 0.8mm; Number of Pins: 2; Length: 1.6mm; REACH SVHC: NoSVHC; Military Standard: Not; Max Operating Temperature: 155degC; Min Operating Temperature: -55degC; Manufacturer URL: http://www.yageo.com/; Datasheet URL: http://www.yageo.com/NewPortal/yageodocoutput?fileName=/pdf/R-Chip/PYu-RC_Group_51_RoHS_L_5.pdf; Weight: 7.1E-05oz; Tolerance: 1%
R56-R61 = CMP-2000-06942-1: as R46 on sheet Ethernet; Package Reference: 0603; Series: RC; Datasheet Version: Rev. 7, 05/2017; Packaging: Reel; Termination Style: SMD/SMT; Datasheet URL: http://www.yageo.com/documents/recent/PYu-RC_Group_51_RoHS_L_7.pdf; Manufacturer URL: http://www.yageo.com/; Package Description: 2-Pin Surface Mount Device, Body 1.6 x 0.8 mm; Case Code - mm: 1608; Case Code - in: 0603; Mounting Technology: SurfaceMount; Operating Temperature Range: -55Cto+155C; Tolerance: 1%; Product: ThickFilmResistorsGeneralPurpose
U5 = CMP-10112-000003-1: IC I/O EXPANDER I2C 8B 16SOIC; Manufacturer: NXP Semiconductors; Interface: I2C,SMBus; Frequency: 100kHz; Nominal Supply Current: 40uA; Max Supply Voltage: 6V; Number Of I/Os: 8; Max Junction Temp: +125°C; Min Supply Voltage: 2.5V; Standoff Height: 0.1mm; RoHS: TRUE; Category: IC; Temperature: -40°C to +85°C; Device Class L3: I/O Expanders; ComponentLink2Description: Datasheet; ComponentLink2URL: https://www.nxp.com/docs/en/data-sheet/PCF8574_PCF8574A.pdf; Digikey Description: IC I/O EXPANDER I2C 8B 16SOIC; Ipc Land Pattern Name: SOIC127P1032X265-16; Mouser Description: PCF8574 Series 2.5 to 6V Remote 8-bit I/O Expander for I2C-bus -SOIC-16; Footprint Url: https://www.nxp.com/docs/en/package-information/SOT162-1.pdf; Lead Free: Yes; Device Class L2: Interface ICs; Ambient Temperature Range Low: -40°C; Temperature Range High: +85°C; Automotive: No; Manufacturer Part Number: PCF8574AT/3,518; Ambient Temperature Range High: +85°C; Height: 2.65mm; Package: SOT162-1; Temperature Range Low: -40°C; Octopart: https://octopart.com/pcf8574at%2F3%2C518-nxp+semiconductors-11541925; Device Class L1: Integrated Circuits (ICs)
U6 = CMP-0777-00307-4: Quadruple 2-Input Positive-AND Gates, NS0014A, LARGE T&R; Manufacturer: Texas Instruments; Technology Family: HC; Schmitt Trigger: No; ICC @ Nom Voltage(Max)(mA): 0.02; Rating: Catalog; Bits(#): 4; Output Type: CMOS; VCC(Max)(V): 6; VCC(Min)(V): 2; tpd @ Nom Voltage(Max)(ns): 28; Voltage(Nom)(V): 5; F @ Nom Voltage(Max)(Mhz): 70; Generic Part Number: SN74HC08; PackageReference: NS0014A; DatasheetVersion: SCLS081F; Input Type: CMOS; Operating Temperature Range(C): -40 to 85
U7 = CMP-1622-00008-3: IC GATE NAND 4CH 2-INP 14SOIC; Number of Bits: 4; Number of Input Lines: 2; Max Supply Voltage: 6V; Operating Supply Voltage: 5V; Min Supply Voltage: 2V; Logic Function: NAND GATE; Low Level Output Current: 5.2mA; Turn-On Delay Time: 23ns; Number of Outputs: 1; Output Current: 25mA; Quiescent Current: 2uA; Schmitt Trigger Input: No; High Level Output Current: -5.2mA; Propagation Delay: 15ns; Radiation Hardening: No; Contact Plating: Tin; Packaging: Tape and Reel; Number of Pins: 14; Max Operating Temperature: 85°C; Mount: Surface Mount; REACH SVHC: No SVHC; Case/Package: SOIC; Package Quantity: 1; Length: 8.65mm; Number of Circuits: 4; Number of Gates: 4; Height: 1.58mm; Min Operating Temperature: -40°C; Weight: 0.004318oz; Number of Output Lines: 1; RoHS Compliant: Yes; Width: 3.91mm; Lead Free: Lead Free; Number of Inputs: 2; Number of Elements: 4

## Sheet CONN.SchDoc
size B
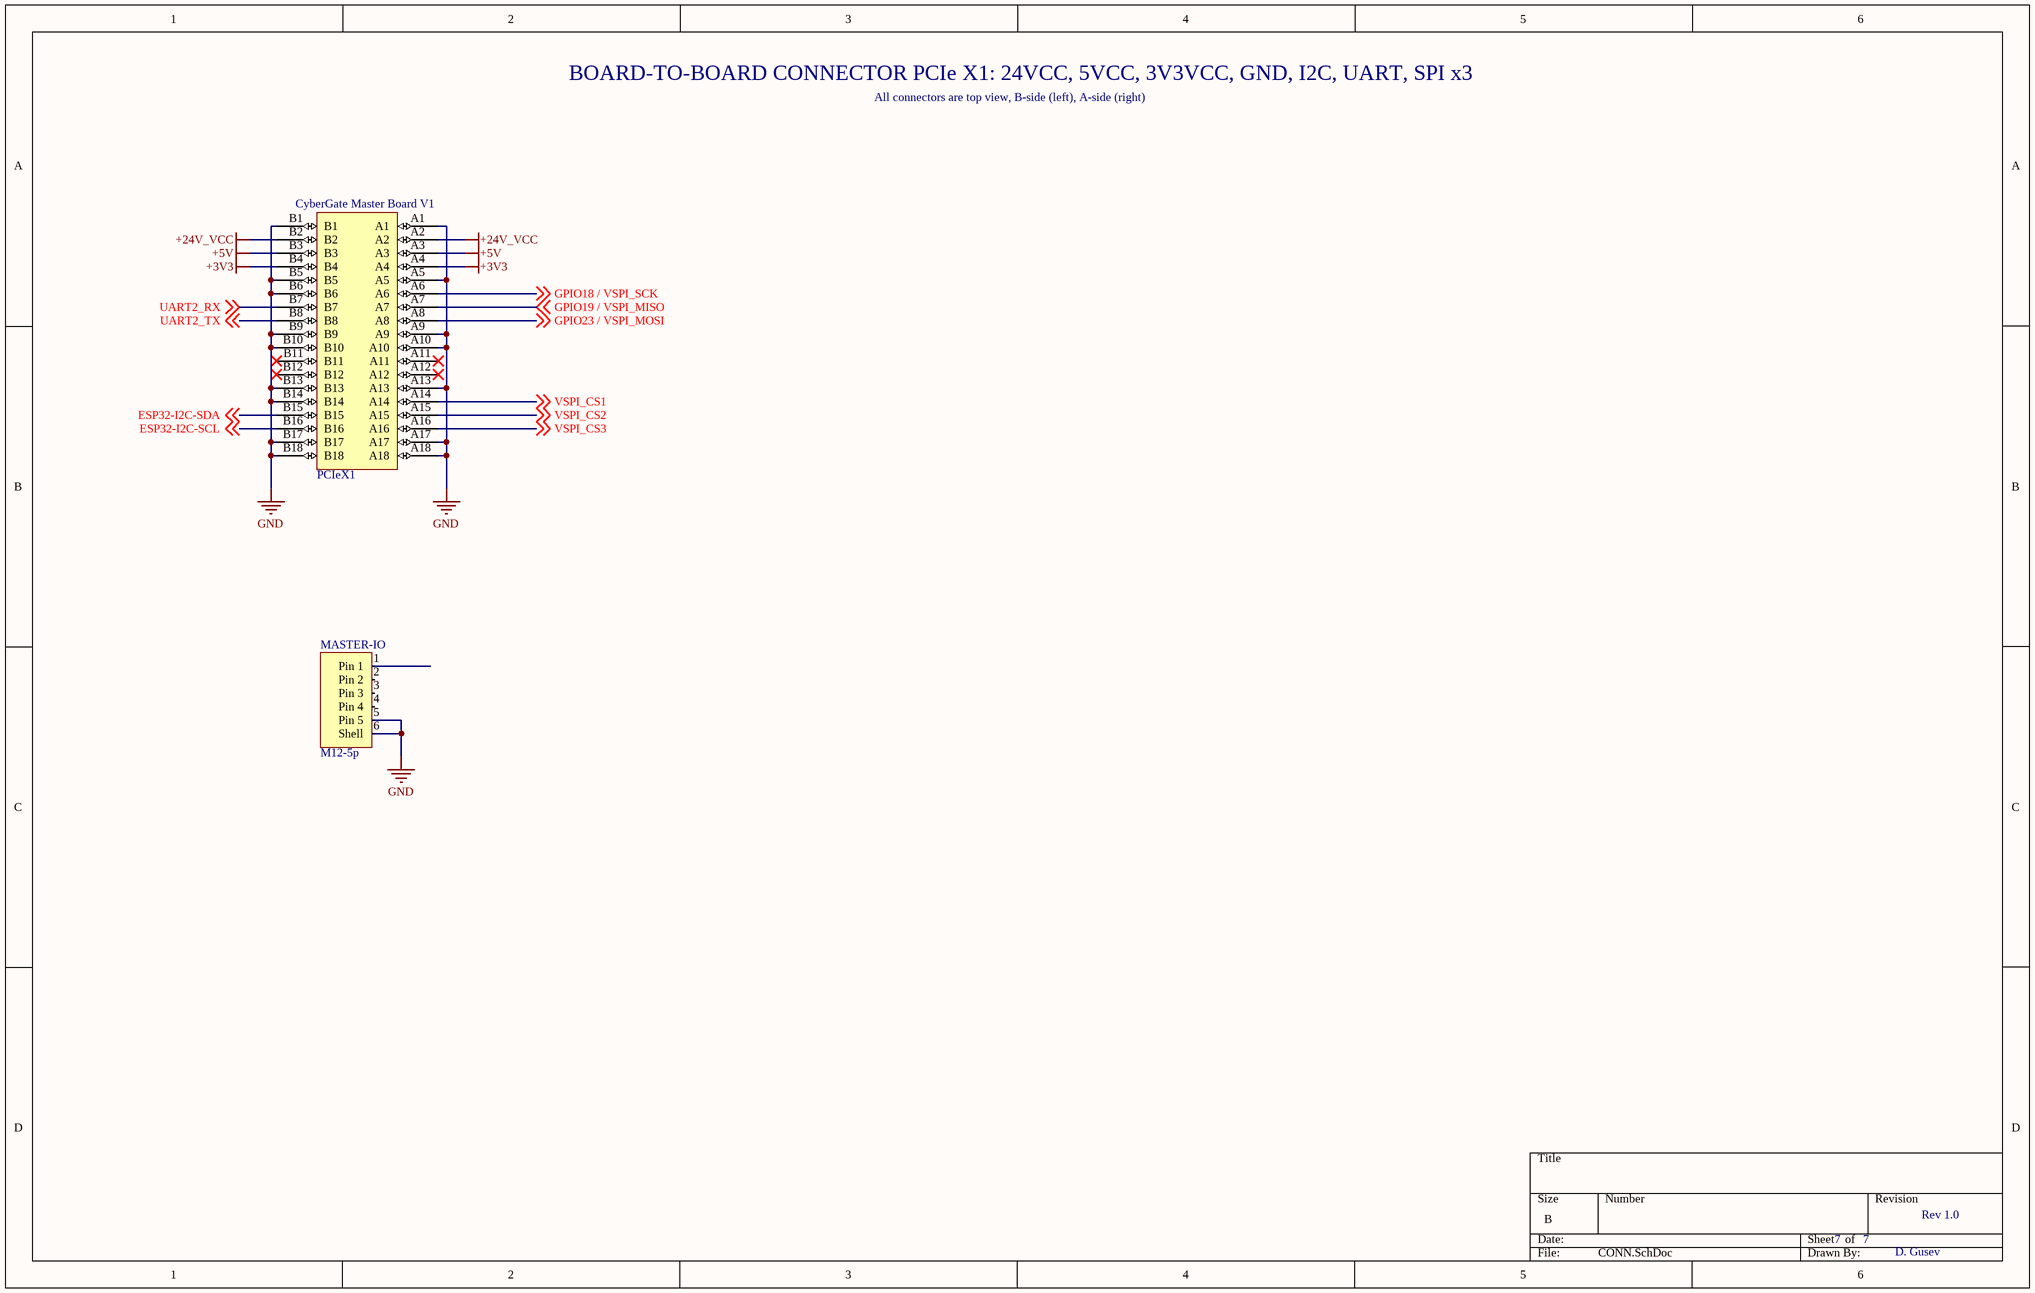
[diagram p7: CONN.SchDoc]

### Parts
CyberGate_Master_Board_V1  PCIeX1  [PCIeX1]
MASTER-IO  M12-5p  [M12-5P]

### Nets
+3V3: CyberGate_Master_Board_V1.A4 CyberGate_Master_Board_V1.B4
+5V: CyberGate_Master_Board_V1.A3 CyberGate_Master_Board_V1.B3
+24V_VCC: CyberGate_Master_Board_V1.A2 CyberGate_Master_Board_V1.B2
GND: CyberGate_Master_Board_V1.A1 CyberGate_Master_Board_V1.A5 CyberGate_Master_Board_V1.A9 CyberGate_Master_Board_V1.A10 CyberGate_Master_Board_V1.A13 CyberGate_Master_Board_V1.A17 CyberGate_Master_Board_V1.A18 CyberGate_Master_Board_V1.B1 CyberGate_Master_Board_V1.B5 CyberGate_Master_Board_V1.B6 CyberGate_Master_Board_V1.B9 CyberGate_Master_Board_V1.B10 CyberGate_Master_Board_V1.B13 CyberGate_Master_Board_V1.B14 CyberGate_Master_Board_V1.B17 CyberGate_Master_Board_V1.B18 MASTER-IO.5(Pin_5) MASTER-IO.6(Shell)
ESP32-I2C-SCL: CyberGate_Master_Board_V1.B16 ; off-sheet ESP32-I2C-SCL
ESP32-I2C-SDA: CyberGate_Master_Board_V1.B15 ; off-sheet ESP32-I2C-SDA
GPIO18 / VSPI_SCK: CyberGate_Master_Board_V1.A6 ; off-sheet GPIO18 / VSPI_SCK
GPIO19 / VSPI_MISO: CyberGate_Master_Board_V1.A7 ; off-sheet GPIO19 / VSPI_MISO
GPIO23 / VSPI_MOSI: CyberGate_Master_Board_V1.A8 ; off-sheet GPIO23 / VSPI_MOSI
UART2_RX: CyberGate_Master_Board_V1.B7 ; off-sheet UART2_RX
UART2_TX: CyberGate_Master_Board_V1.B8 ; off-sheet UART2_TX
VSPI_CS1: CyberGate_Master_Board_V1.A14 ; off-sheet VSPI_CS1
VSPI_CS2: CyberGate_Master_Board_V1.A15 ; off-sheet VSPI_CS2
VSPI_CS3: CyberGate_Master_Board_V1.A16 ; off-sheet VSPI_CS3

Not connected (* = marked no-connect by the designer): CyberGate_Master_Board_V1 A11* A12* B11* B12*; MASTER-IO 1(Pin_1) 2(Pin_2) 3(Pin_3) 4(Pin_4)

### Notes on the sheet
- BOARD-TO-BOARD CONNECTOR PCIe X1: 24VCC, 5VCC, 3V3VCC, GND, I2C, UART, SPI x3
- All connectors are top view, B-side (left), A-side (right)
- 7
- Rev 1.0
- D. Gusev

### Library data of the parts
CyberGate_Master_Board_V1 = PCIeX1: Golden finger, PCIeX16, Dual, Opposite, Pitch 1mm, 164-Position
MASTER-IO = M12-5p: M12 5-pin right angle connector, female

## Nets that join several sheets
+3V3: USB-ESP32 (6 pins), ESP32 (8 pins), LAN9252-2 (DEBUG.5 DEBUG.6), EtherCAT (6 pins), Ethernet (C60.2 L2.1 RJ45.10 RJ45.12), CONN (CyberGate_Master_Board_V1.A4 CyberGate_Master_Board_V1.B4)
+3V3_LAN9252: ESP32 (LAN9252_PWR.2), LAN9252-1 (17 pins)
+3V3_W5500: ESP32 (W5500_PWR.2), Ethernet (9 pins)
+5V: USB-ESP32 (8 pins), LAN9252-2 (DEBUG.3 DEBUG.4), MASTER_GPIO (23 pins), CONN (CyberGate_Master_Board_V1.A3 CyberGate_Master_Board_V1.B3)
+24V_VCC: MASTER_GPIO (Q3.4 Q4.4 Q5.4 Q6.4), CONN (CyberGate_Master_Board_V1.A2 CyberGate_Master_Board_V1.B2)
GND: USB-ESP32 (21 pins), ESP32 (9 pins), LAN9252-1 (30 pins), LAN9252-2 (DEBUG.39 DEBUG.40), EtherCAT (26 pins), Ethernet (30 pins), MASTER_GPIO (29 pins), CONN (18 pins)
VDD33TXRX1: LAN9252-1 (C8.2 C9.2 FB1.2 LAN9252.51), EtherCAT (5 pins)
VDD33TXRX2: LAN9252-1 (C10.2 C11.2 FB2.2 LAN9252.64), EtherCAT (5 pins)
ESP32-I2C-SCL: ESP32 (ESP32.36), MASTER_GPIO (R60.1 U5.14), CONN (CyberGate_Master_Board_V1.B16)
ESP32-I2C-SDA: ESP32 (ESP32.33), MASTER_GPIO (R61.1 U5.15), CONN (CyberGate_Master_Board_V1.B15)
ESP32_RX: USB-ESP32 (U1.20), ESP32 (ESP32.34)
ESP32_TX: USB-ESP32 (U1.4), ESP32 (ESP32.35)
GPIO0: USB-ESP32 (Q2.3), ESP32 (ESP32.25 ESP32_BOOT.2 R11.1)
GPIO0_LAN9252: LAN9252-1 (LAN9252.48), EtherCAT (R25.2 R29.2)
GPIO1_LAN9252: LAN9252-1 (LAN9252.46), EtherCAT (R26.2 R30.2)
GPIO18 / VSPI_SCK: ESP32 (ESP32.30), LAN9252-2 (DEBUG.10 SCK.3), CONN (CyberGate_Master_Board_V1.A6)
GPIO19 / VSPI_MISO: ESP32 (ESP32.31), LAN9252-2 (DEBUG.12 MISO.3), CONN (CyberGate_Master_Board_V1.A7)
GPIO23 / VSPI_MOSI: ESP32 (ESP32.37), LAN9252-2 (DEBUG.38 MOSI.3), CONN (CyberGate_Master_Board_V1.A8)
IRQ: LAN9252-1 (LAN9252.44), LAN9252-2 (DEBUG.26)
NetEtherCAT_EEPROM_5: LAN9252-1 (LAN9252.42), EtherCAT (EtherCAT_EEPROM.5 R33.1)
NetEtherCAT_EEPROM_6: LAN9252-1 (LAN9252.43), EtherCAT (EtherCAT_EEPROM.6 R32.1)
NetLAN9252_45: LAN9252-1 (LAN9252.45), EtherCAT (R27.2 R28.1)
RESET: USB-ESP32 (Q1.3), ESP32 (ESP32.3 ESP32_RESET.2 R10.1)
RXA_N: LAN9252-1 (LAN9252.54), EtherCAT (C34.2 EtherCAT_INPUT.7 R18.1)
RXA_P: LAN9252-1 (LAN9252.55), EtherCAT (C33.2 EtherCAT_INPUT.5 R17.1)
RXB_N: LAN9252-1 (LAN9252.61), EtherCAT (C39.2 EtherCAT_OUTPUT.7 R23.1)
RXB_P: LAN9252-1 (LAN9252.60), EtherCAT (C38.2 EtherCAT_OUTPUT.5 R22.1)
TXA_N: LAN9252-1 (LAN9252.52), EtherCAT (C32.2 EtherCAT_INPUT.3 R16.1)
TXA_P: LAN9252-1 (LAN9252.53), EtherCAT (C31.2 EtherCAT_INPUT.1 R15.1)
TXB_N: LAN9252-1 (LAN9252.63), EtherCAT (C37.2 EtherCAT_OUTPUT.3 R21.1)
TXB_P: LAN9252-1 (LAN9252.62), EtherCAT (C36.2 EtherCAT_OUTPUT.1 R20.1)
UART2_RX: ESP32 (ESP32.27), CONN (CyberGate_Master_Board_V1.B7)
UART2_TX: ESP32 (ESP32.28), CONN (CyberGate_Master_Board_V1.B8)
VSPI_CS1: ESP32 (VSPI_CS1.2), CONN (CyberGate_Master_Board_V1.A14)
VSPI_CS2: ESP32 (VSPI_CS2.2), CONN (CyberGate_Master_Board_V1.A15)
VSPI_CS3: ESP32 (VSPI_CS3.2), CONN (CyberGate_Master_Board_V1.A16)
VSPI_CS_LAN9252: ESP32 (ECAT_CS5.2 ECAT_CS33.2), LAN9252-2 (CS.3 DEBUG.36)
W5500-CS: ESP32 (ESP32.23), Ethernet (R47.1 U4.32)
W5500-MISO: ESP32 (ESP32.14), Ethernet (U4.34)
W5500-MOSI: ESP32 (ESP32.16), Ethernet (U4.35)
W5500-RST: ESP32 (W5500_RST_IO26.2), Ethernet (R48.1 U4.37)
W5500-SCK: ESP32 (ESP32.13), Ethernet (U4.33)